# Altium schematic sheet Power.SchDoc
size B; SheetNumber: 6; SheetTotal: 7
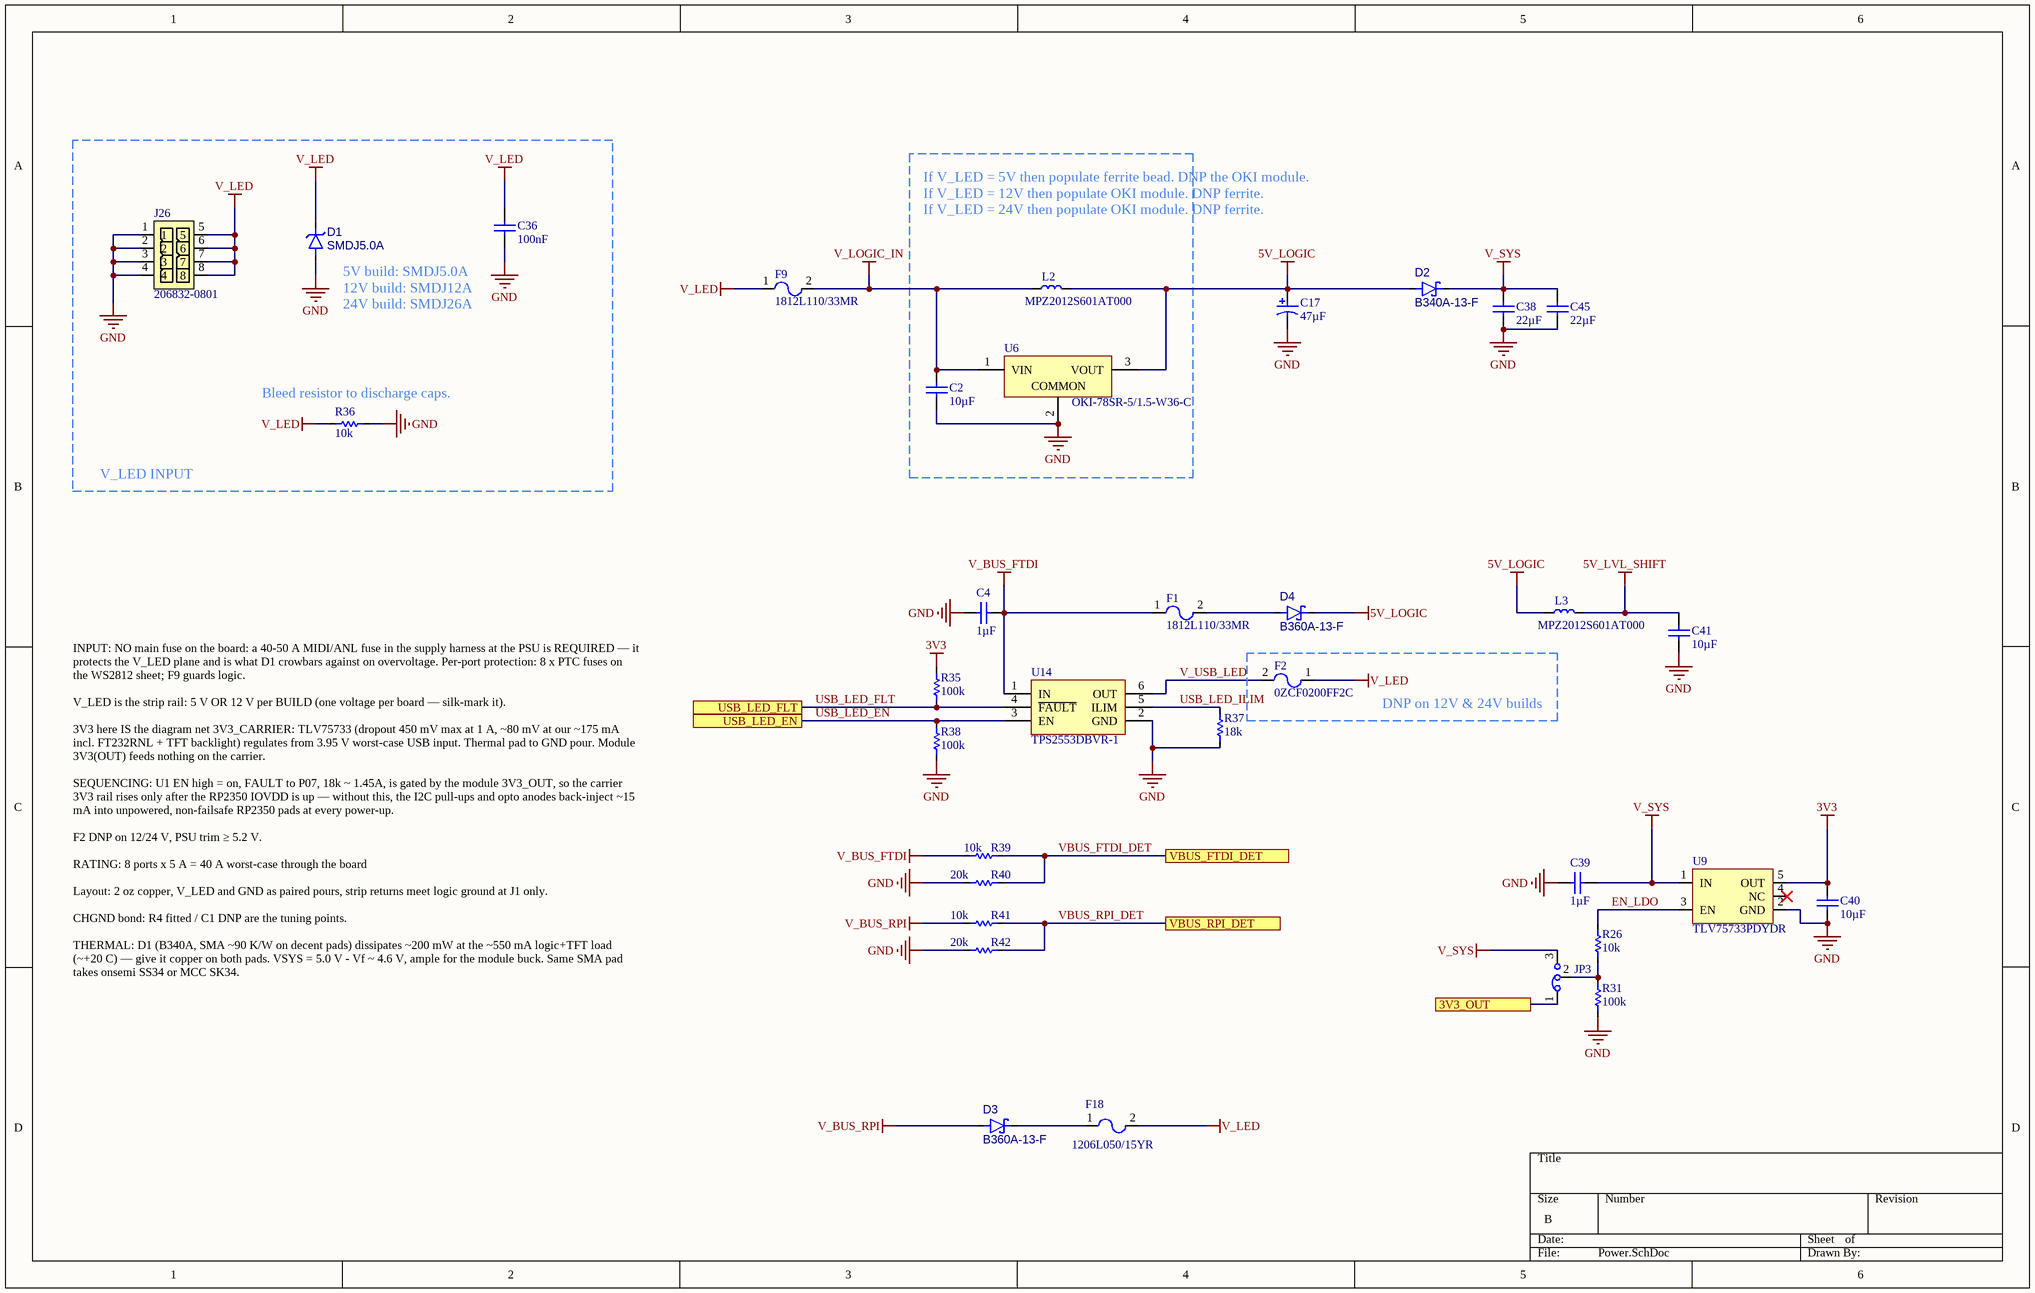
[diagram p0: Power.SchDoc]

## Parts
C2  value 10µF  [CAPC2012X14N_0805_MED]  (hidden comment: GRM21BR61H106KE43L)
C4  value 1µF  [CAPC1608X10N_0603_MED]  (hidden comment: C1608X7R1C105K080AC)
C17  value 47µF  [FP-SP-Cap-X-MFG]  (hidden comment: EEF-CX1C470R)
C36  value 100nF  [CAPC1608X10N_0603_MED]  (hidden comment: CC0603KRX7R0BB104)
C38  value 22µF  [CAPC2012X14N_0805_MED]  (hidden comment: GRM21BC81C226ME44L)
C39  value 1µF  [CAPC1608X10N_0603_MED]  (hidden comment: C1608X7R1C105K080AC)
C40  value 10µF  [CAPC2012X14N_0805_MED]  (hidden comment: GRM21BC81C106KA73L)
C41  value 10µF  [CAPC2012X14N_0805_MED]  (hidden comment: GRM21BC81C106KA73L)
C45  value 22µF  [CAPC2012X14N_0805_MED]  (hidden comment: GRM21BC81C226ME44L)
D1  SMDJ5.0A  [SMDJ_DO-214AB]
D2  B340A-13-F  [DO-214AC_SMA]
D3  B360A-13-F  [FP-SMA-MFG]
D4  B360A-13-F  [FP-SMA-MFG]
F1  1812L110/33MR  [FUSE4532X1.55N_1812MED]
F2  0ZCF0200FF2C  [RESC7451X90M_2920]
F9  1812L110/33MR  [FUSE4532X1.55N_1812MED]
F18  1206L050/15YR  [FP-1206L-MFG]
J26  206832-0801  [206832-0801-Footprint-1]
JP3  Jumper 3 x 1 Bridge 1-2 Solder Bridge  [Jumper 3 Solder Bridge 1-2 0603]  (value not drawn)
L2  MPZ2012S601AT000  [FP-MPZ2012-MFG]
L3  MPZ2012S601AT000  [FP-MPZ2012-MFG]
R26  value 10k  [RESC1608X06N_0603_MED]  (hidden comment: RC0603FR-1010KL)
R31  value 100k  [RESC1608X06N_0603_MED]  (hidden comment: RC0603DR-07100KL)
R35  value 100k  [RESC1608X06N_0603_MED]  (hidden comment: RC0603DR-07100KL)
R36  value 10k  [RESC3116X06N_1206MED]  (hidden comment: RC1206FR-0710KL)
R37  value 18k  [RESC1608X06N_0603_MED]  (hidden comment: RC0603FR-0718KL)
R38  value 100k  [RESC1608X06N_0603_MED]  (hidden comment: RC0603DR-07100KL)
R39  value 10k  [RESC1608X06N_0603_MED]  (hidden comment: RC0603FR-1010KL)
R40  value 20k  [RESC1608X06N_0603_MED]  (hidden comment: RC0603FR-0720KL)
R41  value 10k  [RESC1608X06N_0603_MED]  (hidden comment: RC0603FR-1010KL)
R42  value 20k  [RESC1608X06N_0603_MED]  (hidden comment: RC0603FR-0720KL)
U6  OKI-78SR-5/1.5-W36-C  [MURA-OKI-78SR-3]
U9  TLV75733PDYDR  [SOT95P280X145-5N]
U14  TPS2553DBVR-1  [DBV0006A_N]

## Ports
3V3_OUT, USB_LED_EN, USB_LED_FLT, VBUS_FTDI_DET, VBUS_RPI_DET

## Nets
3V3: C40.2 R35.2 U9.5(OUT)
5V_LOGIC: C17.1 D2.2(A) D4.1(K) L2.2 L3.1 U6.3(VOUT)
5V_LVL_SHIFT: C41.2 L3.2
GND: C2.1 C4.1 C17.2 C36.2 C38.1 C39.1 C40.1 C41.1 C45.1 D1.2(A) J26.1 J26.2 J26.3 J26.4 R31.1 R36.2 R37.1 R38.2 R40.1 R42.1 U6.2(COMMON) U9.2(GND) U14.2(GND)
V_BUS_FTDI: C4.2 F1.1 R39.2 U14.1(IN)
V_BUS_RPI: D3.2(A) R41.2
V_LED: C36.1 D1.1(K) F2.1 F9.1 F18.2 J26.5 J26.6 J26.7 J26.8 R36.1
V_LOGIC_IN: C2.2 F9.2 L2.1 U6.1(VIN)
V_SYS: C38.2 C39.2 C45.2 D2.1(K) JP3.3 U9.1(IN)
3V3_OUT: JP3.1 ; port 3V3_OUT
EN_LDO: R26.2 U9.3(EN)
USB_LED_EN: R38.1 U14.3(EN) ; port USB_LED_EN
USB_LED_FLT: R35.1 U14.4(~{FAULT}) ; port USB_LED_FLT
USB_LED_ILIM: R37.2 U14.5(ILIM)
V_USB_LED: F2.2 U14.6(OUT)
VBUS_FTDI_DET: R39.1 R40.2 ; port VBUS_FTDI_DET
VBUS_RPI_DET: R41.1 R42.2 ; port VBUS_RPI_DET
NetD3_1: D3.1(K) F18.1
NetD4_2: D4.2(A) F1.2
NetJP3_2: JP3.2 R26.1 R31.2

Not connected (* = marked no-connect by the designer): U9 4(NC)*

## Notes on the sheet
- If V_LED = 5V then populate ferrite bead. DNP the OKI module.
  If V_LED = 12V then populate OKI module. DNP ferrite.
  If V_LED = 24V then populate OKI module. DNP ferrite.
- 5V build: SMDJ5.0A
  12V build: SMDJ12A
  24V build: SMDJ26A
- (near R36) Bleed resistor to discharge caps.
- (near R36) V_LED INPUT
- DNP on 12V & 24V builds
- INPUT: NO main fuse on the board: a 40-50 A MIDI/ANL fuse in the supply harness at the PSU is REQUIRED — it protects the V_LED plane and is what D1 crowbars against on overvoltage. Per-port protection: 8 x PTC fuses on the WS2812 sheet; F9 guards logic.
  V_LED is the strip rail: 5 V OR 12 V per BUILD (one voltage per board — silk-mark it).
  3V3 here IS the diagram net 3V3_CARRIER: TLV75733 (dropout 450 mV max at 1 A, ~80 mV at our ~175 mA incl. FT232RNL + TFT backlight) regulates from 3.95 V worst-case USB input. Thermal pad to GND pour. Module 3V3(OUT) feeds nothing on the carrier.
  SEQUENCING: U1 EN high = on, FAULT to P07, 18k ~ 1.45A, is gated by the module 3V3_OUT, so the carrier 3V3 rail rises only after the RP2350 IOVDD is up — without this, the I2C pull-ups and opto anodes back-inject ~15 mA into unpowered, non-failsafe RP2350 pads at every power-up.
  F2 DNP on 12/24 V, PSU trim ≥ 5.2 V.
  RATING: 8 ports x 5 A = 40 A worst-case through the board
  Layout: 2 oz copper, V_LED and GND as paired pours, strip returns meet logic ground at J1 only.
  CHGND bond: R4 fitted / C1 DNP are the tuning points.
  THERMAL: D1 (B340A, SMA ~90 K/W on decent pads) dissipates ~200 mW at the ~550 mA logic+TFT load (~+20 C) — give it copper on both pads. VSYS = 5.0 V - Vf ~ 4.6 V, ample for the module buck. Same SMA pad takes onsemi SS34 or MCC SK34.

## Library data of the parts
C2 = CMP-001-00169-2: Ceramic Capacitor, Multilayer, Ceramic, 10uF, 50V, 10%, X6S, 0805; Case/Package: 0805; Capacitor Type: Ceramic; Mounting Technology: Surface Mount; RoHS Compliant: Yes; Min Operating Temperature: -55°C; Max Operating Temperature: 85°C; Voltage Rating: 50V; Pins: 2; Tolerance: 10%; JLCPN: C440198
C4 C39 = CMP-001-00121-2: Ceramic Capacitor, Multilayer, Ceramic, 16V, 10% +Tol, 10% -Tol, X7R, 15% TC, 1uF, Surface Mount, 0603; Mounting Technology: Surface Mount; Min Operating Temperature: -55°C; Voltage Rating: 16V; Case/Package: 0603; Capacitor Type: Ceramic; JLCPN: C59782; Tolerance: 10%; Pins: 2; RoHS Compliant: Yes; Max Operating Temperature: 125°C
C17 = CMP-001-00179-1: Polymer Aluminum Electrolytic Capacitor, 47 µF, -55 to 105 ¡C; Ripple Current: 1.6A; Tolerance: 20%; Voltage Rating: 16V; Case/Package: 2917; Mounting Technology: Surface Mount; Min Operating Temperature: -55°C; Max Operating Temperature: 105°C
C36 = CMP-001-00102-4: Ceramic Capacitor, Multilayer, Ceramic, 100V, 10% +Tol, 10% -Tol, X7R, 15% TC, 0.1uF, Surface Mount, 0603; Max Operating Temperature: 125°C; RoHS Compliant: Yes; Case/Package: 0603; Mounting Technology: Surface Mount; Capacitor Type: Ceramic; Pins: 2; Voltage Rating: 100V; Min Operating Temperature: -55°C; JLCPN: C113803
C38 C45 = CMP-001-00095-1: Ceramic Capacitor, Multilayer, Ceramic, 22uF, 16V, 20%, X6S, 0805; Case/Package: 0805; Capacitor Type: Ceramic; Mounting Technology: Surface Mount; RoHS Compliant: Yes; Min Operating Temperature: -55°C; Max Operating Temperature: 105°C; Voltage Rating: 16V; Pins: 2; Tolerance: 20%
C40 C41 = CMP-001-00084-4: Ceramic Capacitor, Multilayer, Ceramic, 10uF, 16V, 10%, X6S, 0805; RoHS Compliant: Yes; Case/Package: 0805; Pins: 2; Min Operating Temperature: -55°C; Voltage Rating: 16V; JLCPN: C162413; Capacitor Type: Ceramic; Tolerance: 10%; Mounting Technology: Surface Mount; Max Operating Temperature: 105°C
D1 = CMP-004-00055-2: SMDJ Series 6.5 W 7 V Uni-Directional Surface Mount TVS Diode - SMC; Max Surge Current: 326.1A; Min Operating Temperature: -65°C; Max Operating Temperature: 150°C; Mounting Technology: Surface Mount; Pins: 2
D2 = CMP-004-00034-2: Rectifier Diode, Schottky, 1 Phase, 1 Element, 3A, 40V V(RRM), Silicon; Forward Voltage: 500mV; Pins: 2; Max Operating Temperature: 125°C; RoHS Compliant: Yes; Min Operating Temperature: -55°C
D3 D4 = CMP-004-00054-1: Rectifier Diode, Schottky, 1 Phase, 1 Element, 3A, 60V V(RRM), Silicon, DO-214AC; Forward Voltage: 700mV; Forward Current: 3A; Pins: 2; Max Operating Temperature: 150°C; Case/Package: SMA; Min Operating Temperature: -55°C; Mounting Technology: Surface Mount
F1 F9 = CMP-005-00022-1: PTC Resettable Fuse 1.1A(hold) 1.95A(trip) 33VDC 20A 0.8W 0.5s 0.06Ohm SMD Solder Pad 1812 T/R; Trip Current Rating: 1.9A; Hold Current Rating: 1.1A; Mounting Technology: Surface Mount; Case/Package: 1812; Min Operating Temperature: -40°C; Max Operating Temperature: 85°C
F2 = CMP-005-00026-1: SMD Resettable Fuse, PPTC, 2920 [7351 Metric], 0ZCF, 16 VDC, 2 A, 4 A, 4.5 s; Mounting Technology: Surface Mount; Min Operating Temperature: -40°C; Max Operating Temperature: 85°C
F18 = CMP-005-00020-2: PTC Resettable Fuse 0.5A(hold) 1A(trip) 15VDC 100A 0.6W 0.1s 0.15Ohm SMD Solder Pad 1206 T/R; Case/Package: 1206; Min Operating Temperature: -40°C; Current Rating: 100A; Max Operating Temperature: 85°C; JLCPN: C151162; Mounting Technology: Surface Mount
J26 = CMP-002-00208-6: Micro-Fit+, Vertical Header, 8 pin; Max Current Rating: 12.5A; Connector Type: Micro-Fit+; Mounting Technology: Through Hole; Pins: 8
JP3 = CMP-009-00341-2: 0603 Solder Bridge Jumper Surface Mount; Tolerance: 1%; Voltage Rating: 75V; Value: 0; Pins: 2; Case/Package: 0603; RoHS Compliant: Yes; Max Operating Temperature: 155°C; Min Operating Temperature: -55°C; Mounting Technology: Surface Mount
L2 L3 = CMP-006-00035-1: Ferrite Beads Multi-Layer Power 600Ohm 25% 100MHz 2A 0.1Ohm DCR 0805 T/R; Tolerance: 25%; Case/Package: 0805; Mounting Technology: Surface Mount; Current Rating: 2A; Max Operating Temperature: 125°C; Min Operating Temperature: -55°C
R26 R39 R41 = CMP-009-00306-2: Fixed Resistor, Metal Glaze/thick Film, 0.1W, 10000ohm, 75V, 1% +/-Tol, 100ppm/Cel, Surface Mount, 0603; Power: 100mW; Voltage Rating: 50V; Max Operating Temperature: 155°C; Min Operating Temperature: -55°C; JLCPN: C98220; Mounting Technology: Surface Mount; Case/Package: 0603; Tolerance: 1%; RoHS Compliant: Yes; Pins: 2
R31 R35 R38 = CMP-009-00328-3: Fixed Resistor, Metal Glaze/thick Film, 0.1W, 100000ohm, 75V, 0.5% +/-Tol, 100ppm/Cel, Surface Mount, 0603; Power: 100mW; Voltage Rating: 50V; Min Operating Temperature: -55°C; Mounting Technology: Surface Mount; RoHS Compliant: Yes; Pins: 2; JLCPN: C25803; Max Operating Temperature: 155°C; Case/Package: 0603; Tolerance: 0.5%
R36 = CMP-009-00344-1: Fixed Resistor, Metal Glaze/thick Film, 0.25W, 20000ohm, 200V, 1% +/-Tol, 100ppm/Cel, Surface Mount, 1206; Power: 250mW; RoHS Compliant: Yes; Voltage Rating: 200V; Pins: 2; Max Operating Temperature: 155°C; Case/Package: 1206; Mounting Technology: Surface Mount; Tolerance: 1%; Min Operating Temperature: -55°C
R37 = CMP-009-00346-2: 100mW Thick Film Resistors 75V ±100ppm/℃ ±1% 18kΩ 0603 Chip Resistor - Surface Mount ROHS; Tolerance: 1%; Power: 100mW; Case/Package: 0603; Mounting Technology: Surface Mount; RoHS Compliant: Yes; Min Operating Temperature: -55°C; Pins: 2; Max Operating Temperature: 155°C; Voltage Rating: 75V
R40 R42 = CMP-009-00345-1: 100mW Thick Film Resistors 75V ±100ppm/℃ ±1% 20kΩ 0603 Chip Resistor - Surface Mount ROHS; JLCPN: C123417; Tolerance: 1%; Min Operating Temperature: -55°C; Pins: 2; Mounting Technology: Surface Mount; Case/Package: 0603; RoHS Compliant: Yes; Max Operating Temperature: 155°C; Power: 100mW; Voltage Rating: 75V
U6 = CMP-019-00084-3: 8 W Single Output 5 V Non Isolated Through Hole DC/DC Converter; Max Power Dissipation: 7.8W; Min Supply Voltage: 7V; Output Voltage: 5V; Output Current: 1.5A; Max Supply Voltage: 36V; Case/Package: SMA; Pins: 3; Max Operating Temperature: 85°C; Mounting Technology: Through Hole; Min Operating Temperature: -40°C
U9 = CMP-019-00080-1: 1-A, low-IQ high-accuracy low-dropout (LDO) voltage regulator with enable 5-SOT-23 -40 to 125; Max Supply Voltage: 5.5V; Dropout Voltage: 425mV; Output Voltage: 3.3V; Case/Package: SOT-23; Pins: 5
U14 = CMP-019-00083-1: IC PWR SWITCH N-CHAN 1: 1 SOT23-6 Power Switch/Driver 1: 1 N-Channel 1.5A SOT-23-6; Max Supply Voltage: 6.5V; Min Supply Voltage: 2.5V; Min Operating Temperature: -40°C; Pins: 6; Max Operating Temperature: 85°C; Case/Package: SOT-23